# Altium schematic sheet CPU_CONN1.SchDoc
size A4; SheetNumber: 1; SheetTotal: 16
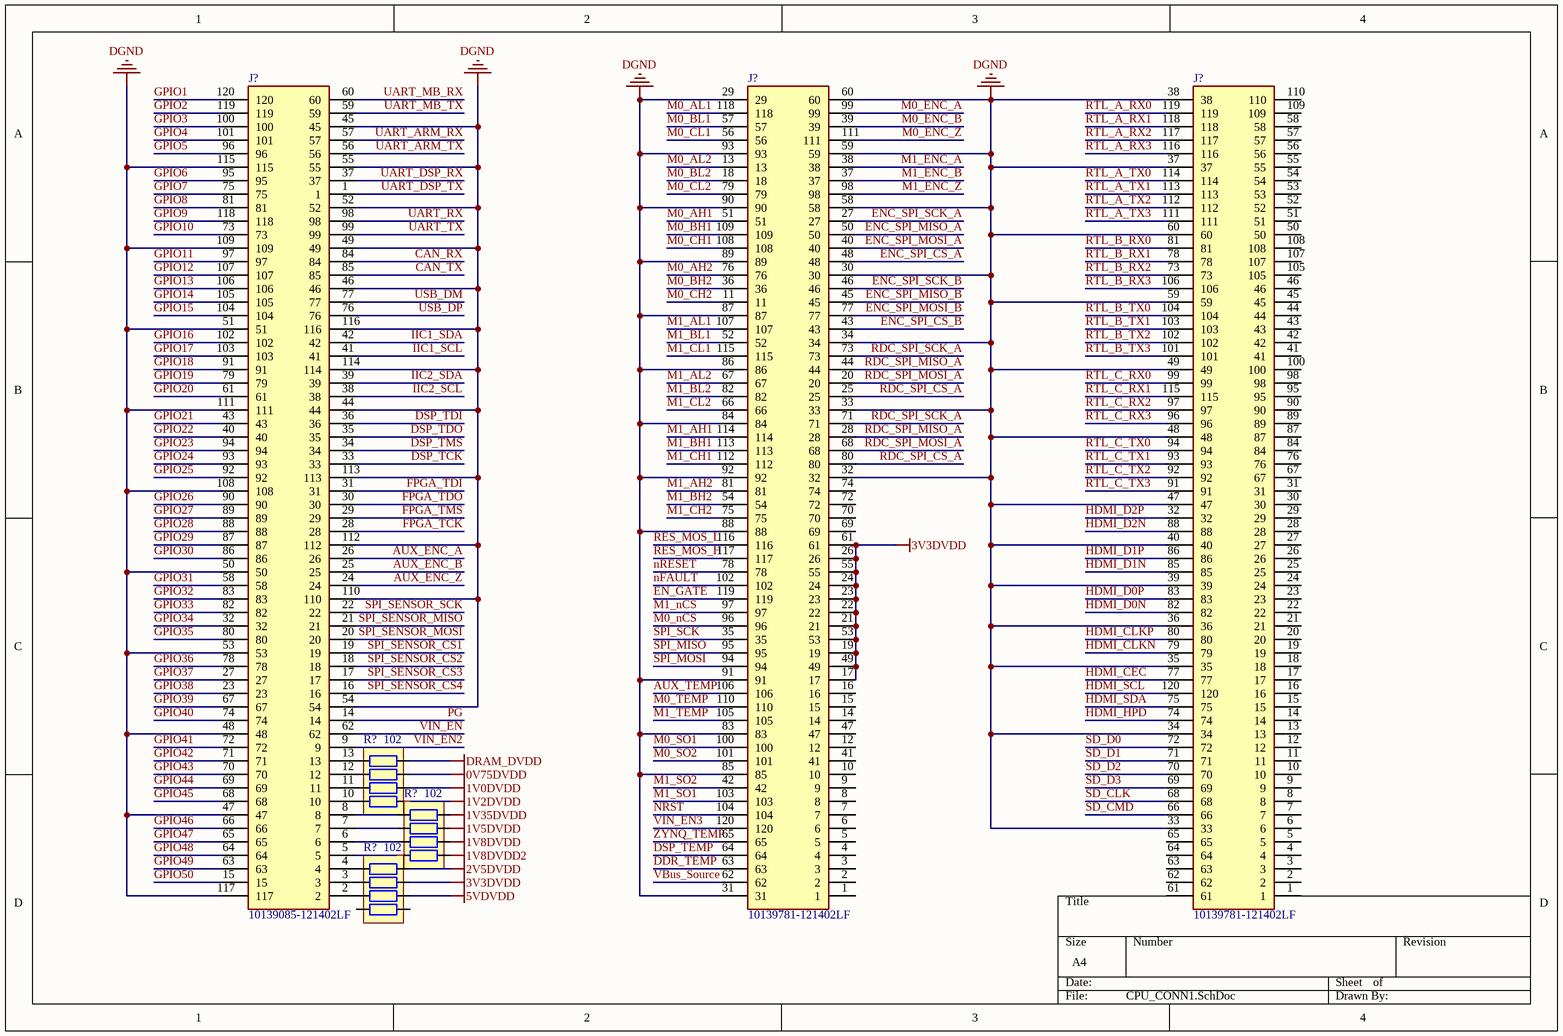
[diagram p0: CPU_CONN1.SchDoc]

## Parts
(Parts that share a designator on the sheet are numbered #1, #2 ... from top to bottom, then left to right.)
J?#1  10139085-121402LF  [10139085121402LF]
J?#2  10139781-121402LF  [10139781121402LF]
J?#3  10139781-121402LF  [10139781121402LF]
R?#1  102  [RCA-8P4R-0603]
R?#2  102  [RCA-8P4R-0603]
R?#3  102  [RCA-8P4R-0603]

## Nets
0V75DVDD: R?#1.7
1V0DVDD: R?#1.6
1V2DVDD: R?#1.5
1V5DVDD: R?#2.7
1V8DVDD: R?#2.6
1V8DVDD2: R?#2.5
1V35DVDD: R?#2.8
2V5DVDD: R?#3.8
3V3DVDD: J?#2.17 J?#2.19 J?#2.21 J?#2.22 J?#2.23 J?#2.24 J?#2.26 J?#2.49 J?#2.53 J?#2.55 J?#2.61 R?#3.7
5VDVDD: R?#3.6
DGND: J?#1.44 J?#1.45 J?#1.46 J?#1.47 J?#1.48 J?#1.49 J?#1.50 J?#1.51 J?#1.52 J?#1.53 J?#1.54 J?#1.55 J?#1.108 J?#1.109 J?#1.110 J?#1.111 J?#1.112 J?#1.113 J?#1.114 J?#1.115 J?#1.116 J?#1.117 J?#2.29 J?#2.30 J?#2.31 J?#2.32 J?#2.33 J?#2.34 J?#2.58 J?#2.59 J?#2.60 J?#2.83 J?#2.84 J?#2.85 J?#2.86 J?#2.87 J?#2.88 J?#2.89 J?#2.90 J?#2.91 J?#2.92 J?#2.93 J?#3.33 J?#3.34 J?#3.35 J?#3.36 J?#3.37 J?#3.38 J?#3.39 J?#3.40 J?#3.47 J?#3.48 J?#3.49 J?#3.59 J?#3.60
DRAM_DVDD: R?#1.8
AUX_ENC_A: J?#1.26
AUX_ENC_B: J?#1.25
AUX_ENC_Z: J?#1.24
AUX_TEMP: J?#2.106
CAN_RX: J?#1.84
CAN_TX: J?#1.85
DDR_TEMP: J?#2.63
DSP_TCK: J?#1.33
DSP_TDI: J?#1.36
DSP_TDO: J?#1.35
DSP_TEMP: J?#2.64
DSP_TMS: J?#1.34
EN_GATE: J?#2.119
ENC_SPI_CS_A: J?#2.48
ENC_SPI_CS_B: J?#2.43
ENC_SPI_MISO_A: J?#2.50
ENC_SPI_MISO_B: J?#2.45
ENC_SPI_MOSI_A: J?#2.40
ENC_SPI_MOSI_B: J?#2.77
ENC_SPI_SCK_A: J?#2.27
ENC_SPI_SCK_B: J?#2.46
FPGA_TCK: J?#1.28
FPGA_TDI: J?#1.31
FPGA_TDO: J?#1.30
FPGA_TMS: J?#1.29
GPIO1: J?#1.120
GPIO2: J?#1.119
GPIO3: J?#1.100
GPIO4: J?#1.101
GPIO5: J?#1.96
GPIO6: J?#1.95
GPIO7: J?#1.75
GPIO8: J?#1.81
GPIO9: J?#1.118
GPIO10: J?#1.73
GPIO11: J?#1.97
GPIO12: J?#1.107
GPIO13: J?#1.106
GPIO14: J?#1.105
GPIO15: J?#1.104
GPIO16: J?#1.102
GPIO17: J?#1.103
GPIO18: J?#1.91
GPIO19: J?#1.79
GPIO20: J?#1.61
GPIO21: J?#1.43
GPIO22: J?#1.40
GPIO23: J?#1.94
GPIO24: J?#1.93
GPIO25: J?#1.92
GPIO26: J?#1.90
GPIO27: J?#1.89
GPIO28: J?#1.88
GPIO29: J?#1.87
GPIO30: J?#1.86
GPIO31: J?#1.58
GPIO32: J?#1.83
GPIO33: J?#1.82
GPIO34: J?#1.32
GPIO35: J?#1.80
GPIO36: J?#1.78
GPIO37: J?#1.27
GPIO38: J?#1.23
GPIO39: J?#1.67
GPIO40: J?#1.74
GPIO41: J?#1.72
GPIO42: J?#1.71
GPIO43: J?#1.70
GPIO44: J?#1.69
GPIO45: J?#1.68
GPIO46: J?#1.66
GPIO47: J?#1.65
GPIO48: J?#1.64
GPIO49: J?#1.63
GPIO50: J?#1.15
HDMI_CEC: J?#3.77
HDMI_CLKN: J?#3.79
HDMI_CLKP: J?#3.80
HDMI_D0N: J?#3.82
HDMI_D0P: J?#3.83
HDMI_D1N: J?#3.85
HDMI_D1P: J?#3.86
HDMI_D2N: J?#3.88
HDMI_D2P: J?#3.32
HDMI_HPD: J?#3.74
HDMI_SCL: J?#3.120
HDMI_SDA: J?#3.75
IIC1_SCL: J?#1.41
IIC1_SDA: J?#1.42
IIC2_SCL: J?#1.38
IIC2_SDA: J?#1.39
M0_AH1: J?#2.51
M0_AH2: J?#2.76
M0_AL1: J?#2.118
M0_AL2: J?#2.13
M0_BH1: J?#2.109
M0_BH2: J?#2.36
M0_BL1: J?#2.57
M0_BL2: J?#2.18
M0_CH1: J?#2.108
M0_CH2: J?#2.11
M0_CL1: J?#2.56
M0_CL2: J?#2.79
M0_ENC_A: J?#2.99
M0_ENC_B: J?#2.39
M0_ENC_Z: J?#2.111
M0_nCS: J?#2.96
M0_SO1: J?#2.100
M0_SO2: J?#2.101
M0_TEMP: J?#2.110
M1_AH1: J?#2.114
M1_AH2: J?#2.81
M1_AL1: J?#2.107
M1_AL2: J?#2.67
M1_BH1: J?#2.113
M1_BH2: J?#2.54
M1_BL1: J?#2.52
M1_BL2: J?#2.82
M1_CH1: J?#2.112
M1_CH2: J?#2.75
M1_CL1: J?#2.115
M1_CL2: J?#2.66
M1_ENC_A: J?#2.38
M1_ENC_B: J?#2.37
M1_ENC_Z: J?#2.98
M1_nCS: J?#2.97
M1_SO1: J?#2.103
M1_SO2: J?#2.42
M1_TEMP: J?#2.105
~{NRST}: J?#2.104
nFAULT: J?#2.102
nRESET: J?#2.78
PG: J?#1.14
RDC_SPI_CS_A: J?#2.25 J?#2.80
RDC_SPI_MISO_A: J?#2.28 J?#2.44
RDC_SPI_MOSI_A: J?#2.20 J?#2.68
RDC_SPI_SCK_A: J?#2.71 J?#2.73
RES_MOS_H: J?#2.117
RES_MOS_L: J?#2.116
RTL_A_RX0: J?#3.119
RTL_A_RX1: J?#3.118
RTL_A_RX2: J?#3.117
RTL_A_RX3: J?#3.116
RTL_A_TX0: J?#3.114
RTL_A_TX1: J?#3.113
RTL_A_TX2: J?#3.112
RTL_A_TX3: J?#3.111
RTL_B_RX0: J?#3.81
RTL_B_RX1: J?#3.78
RTL_B_RX2: J?#3.73
RTL_B_RX3: J?#3.106
RTL_B_TX0: J?#3.104
RTL_B_TX1: J?#3.103
RTL_B_TX2: J?#3.102
RTL_B_TX3: J?#3.101
RTL_C_RX0: J?#3.99
RTL_C_RX1: J?#3.115
RTL_C_RX2: J?#3.97
RTL_C_RX3: J?#3.96
RTL_C_TX0: J?#3.94
RTL_C_TX1: J?#3.93
RTL_C_TX2: J?#3.92
RTL_C_TX3: J?#3.91
SD_CLK: J?#3.68
SD_CMD: J?#3.66
SD_D0: J?#3.72
SD_D1: J?#3.71
SD_D2: J?#3.70
SD_D3: J?#3.69
SPI_MISO: J?#2.95
SPI_MOSI: J?#2.94
SPI_SCK: J?#2.35
SPI_SENSOR_CS1: J?#1.19
SPI_SENSOR_CS2: J?#1.18
SPI_SENSOR_CS3: J?#1.17
SPI_SENSOR_CS4: J?#1.16
SPI_SENSOR_MISO: J?#1.21
SPI_SENSOR_MOSI: J?#1.20
SPI_SENSOR_SCK: J?#1.22
UART_ARM_RX: J?#1.57
UART_ARM_TX: J?#1.56
UART_DSP_RX: J?#1.37
UART_DSP_TX: J?#1.1
UART_MB_RX: J?#1.60
UART_MB_TX: J?#1.59
UART_RX: J?#1.98
UART_TX: J?#1.99
USB_DM: J?#1.77
USB_DP: J?#1.76
VBus_Source: J?#2.62
VIN_EN: J?#1.62
VIN_EN2: J?#1.9
VIN_EN3: J?#2.120
ZYNQ_TEMP: J?#2.65
NetJ?#1_2: J?#1.2 R?#3.3
NetJ?#1_3: J?#1.3 R?#3.2
NetJ?#1_4: J?#1.4 R?#3.1
NetJ?#1_5: J?#1.5 R?#2.4
NetJ?#1_6: J?#1.6 R?#2.3
NetJ?#1_7: J?#1.7 R?#2.2
NetJ?#1_8: J?#1.8 R?#2.1
NetJ?#1_10: J?#1.10 R?#1.4
NetJ?#1_11: J?#1.11 R?#1.3
NetJ?#1_12: J?#1.12 R?#1.2
NetJ?#1_13: J?#1.13 R?#1.1

Not connected (* = marked no-connect by the designer): J?#2 1 2 3 4 5 6 7 8 9 10 12 14 15 16 41 47 69 70 72 74; J?#3 1 2 3 4 5 6 7 8 9 10 11 12 13 14 15 16 17 18 19 20 21 22 23 24 25 26 27 28 29 30 31 41 42 43 44 45 46 50 51 52 53 54 55 56 57 58 61 62 63 64 65 67 76 84 87 89 90 95 98 100 105 107 108 109 110; R?#3 4 5

## Library data of the parts
J?#1 = 10139085-121402LF: Connector FE; Manufacturer_Name: Amphenol Communications Solutions; Manufacturer_Part_Number: 10139781-121402LF; Datasheet Link: https://cdn.amphenol-cs.com/media/wysiwyg/files/drawing/10139781.pdf; Height: 4.3mm
J?#2 J?#3 = 10139781-121402LF: Connector M; Manufacturer_Name: Amphenol Communications Solutions; Datasheet Link: https://cdn.amphenol-cs.com/media/wysiwyg/files/drawing/10139781.pdf; Height: 4.3mm; Manufacturer_Part_Number: 10139781-121402LF
R?#1-R?#3 = R-8P4R: 贴片排阻; BOM名称: 贴片网络排阻; 版权归属: 封装库来自淘宝 ID：黄晶宝石; 联系售后: https://shop463601444.taobao.com